# Altium project 数控模块.PrjPcb
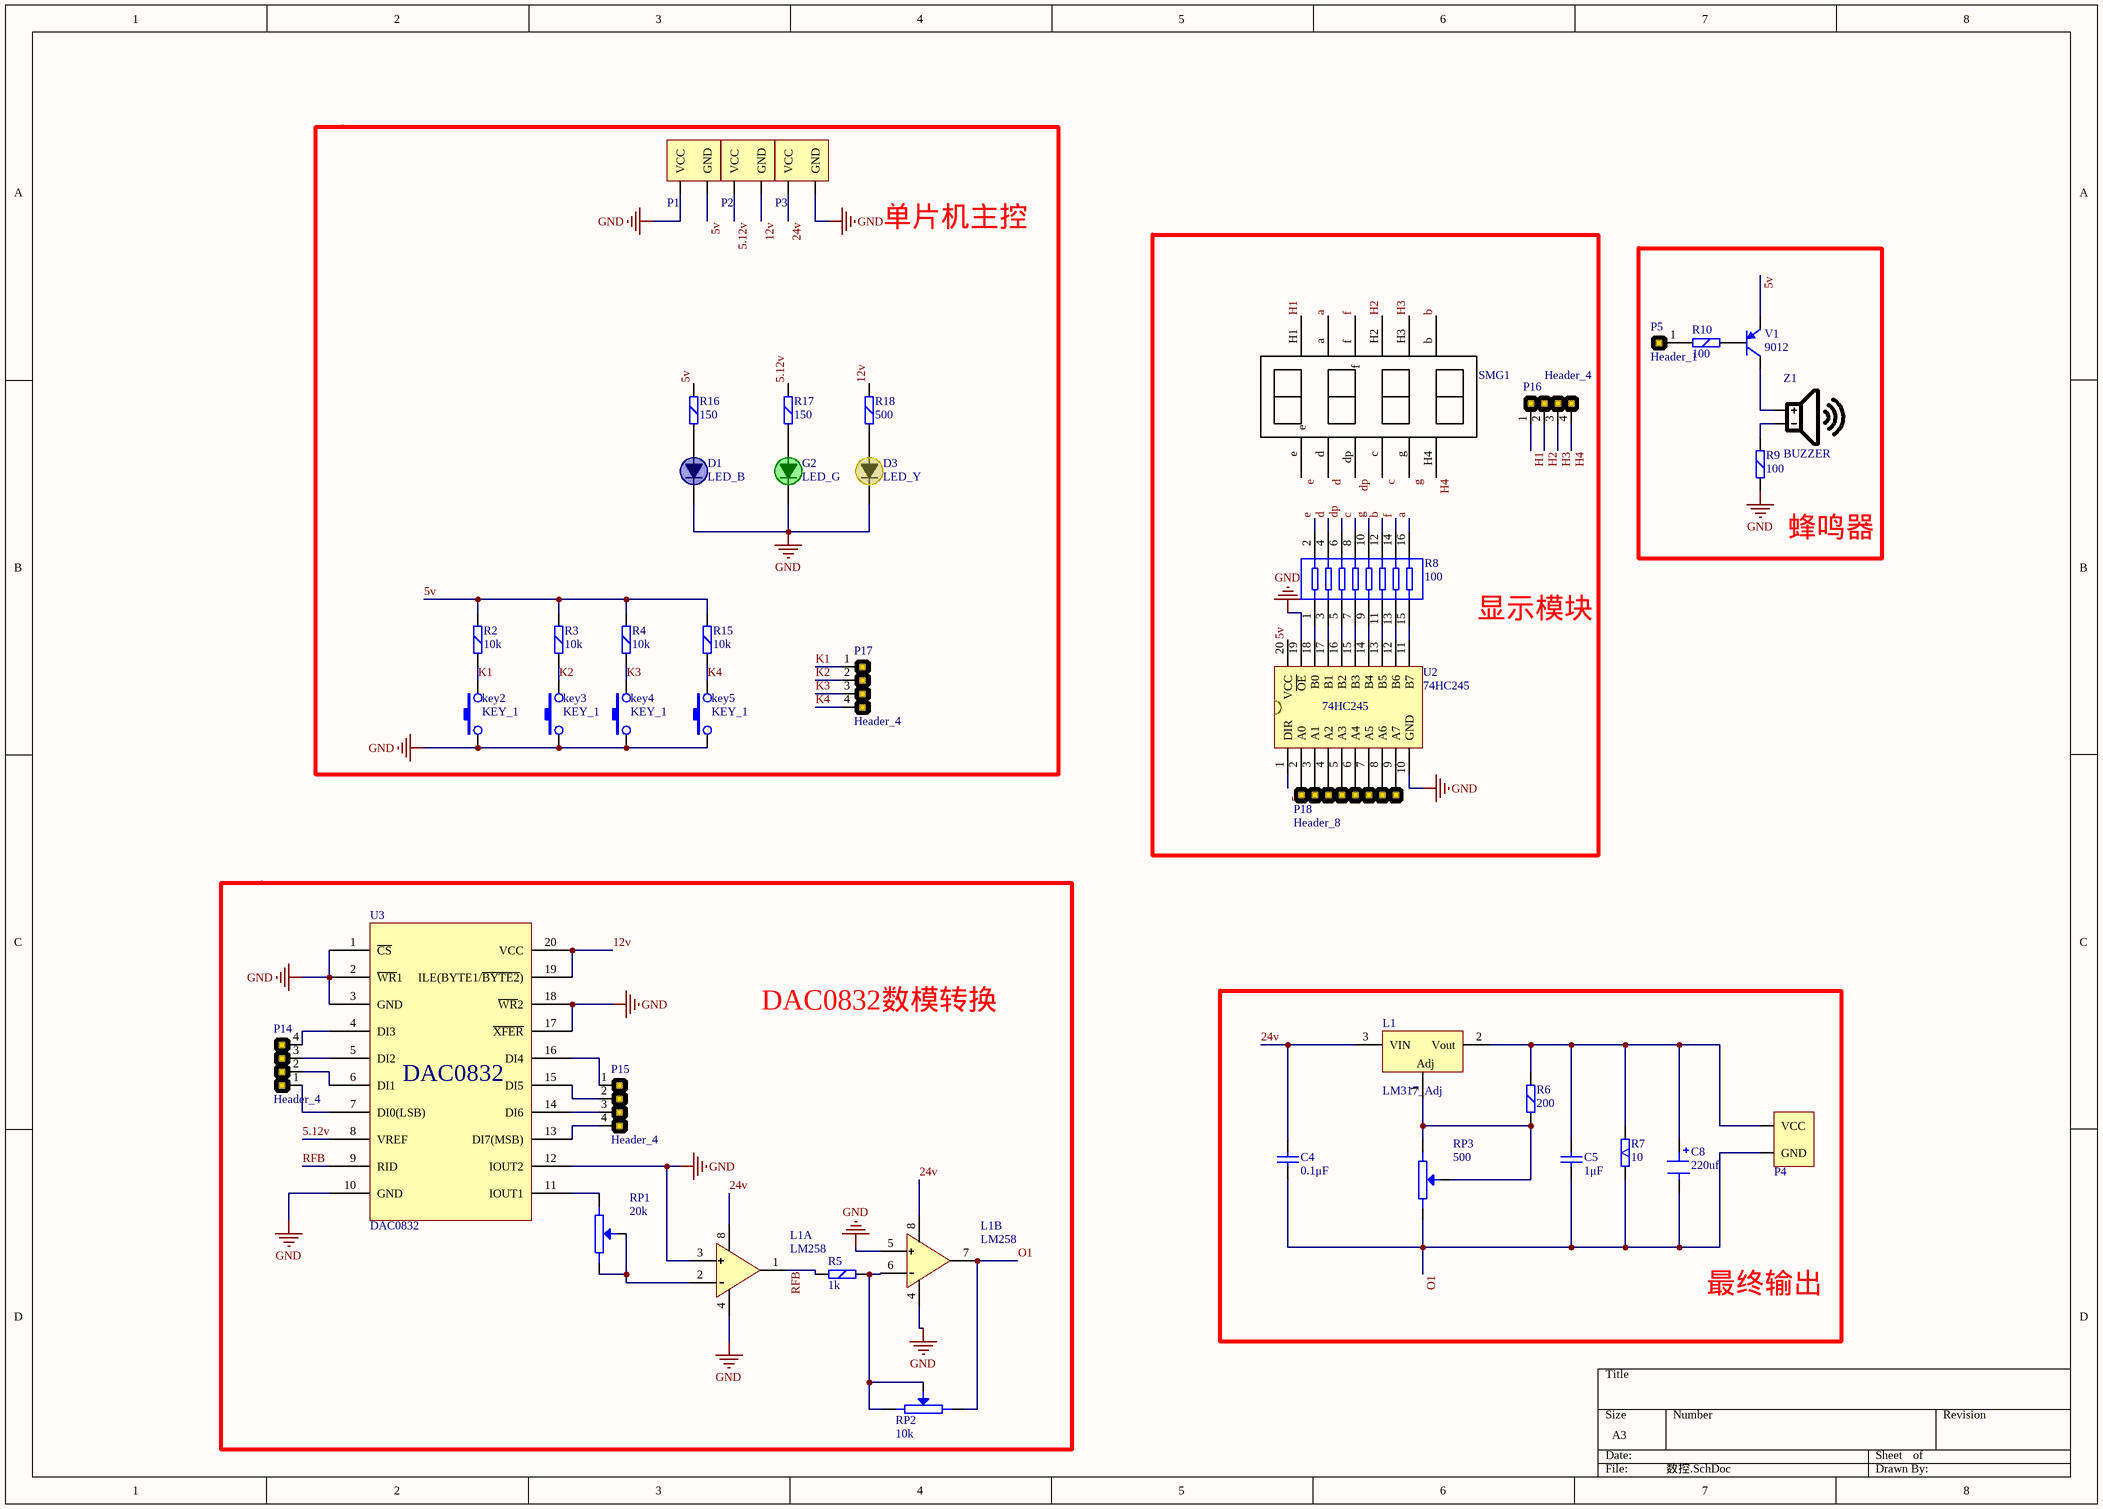
[diagram p0: 数控.SchDoc]
1 sheet, 43 parts. Net scope: global (net labels, ports and power ports of the same name join across sheets).
Board files: 数控_1.PcbDoc, 数控_2.PcbDoc

## Sheet 数控.SchDoc
size A3

### Parts
(Parts that share a designator on the sheet are numbered #1, #2 ... from top to bottom, then left to right.)
C4  0.1μF  [电容_瓷片]
C5  1μF  [电容_瓷片]
C8  220uf  [电解电容_小]
D1  LED_B  [LED_B]
D3  LED_Y  [LED_Y]
G2  LED_G  [LED_G]
key2  KEY_1  [AN66]
key3  KEY_1  [AN66]
key4  KEY_1  [AN66]
key5  KEY_1  [AN66]
L1#1  LM317_Adj  [7805散热器]
L1#2  LM258  [DIP8]  (parts A,B of 2)
P1  电源端子2P  [端子 - duplicate]  (value not drawn)
P2  电源端子2P  [端子 - duplicate]  (value not drawn)
P3  电源端子2P  [端子 - duplicate]  (value not drawn)
P4  电源端子2P  [端子 - duplicate]  (value not drawn)
P5  Header_1  [Header_1]
P14  Header_4  [Header_4]
P15  Header_4  [Header_4]
P16  Header_4  [Header_4]
P17  Header_4  [Header_4]
P18  Header_8  [Header_8]
R2  10k  [1/4WA1]
R3  10k  [1/4WA1]
R4  10k  [1/4WA1]
R5  1k  [1/4WA1]
R6  200  [1/4WA1]
R7  10  [AXIAL-20*5MM-W]
R8  100  [RES_PACK - 2]
R9  100  [1/4WA1]
R10  100  [1/4WA1]
R15  10k  [1/4WA1]
R16  150  [1/4WA1]
R17  150  [1/4WA1]
R18  500  [1/4WA1]
RP1  20k  [3296-203]
RP2  10k  [3296-100]
RP3  500  [3296-103]
SMG1  数码管  [4IN1B - 0.4英寸]  (value not drawn)
U2  74HC245  [DIP20]
U3  DAC0832  [DIP20]
V1  9012  [三极管PNP]
Z1  BUZZER  [BUZZER]

### Blocks framed on the sheet
单片机主控: D1 D3 G2 key2-key5 P1-P3 P17 R2-R4 R15-R18
显示模块: P16 P18 R8 SMG1 U2
蜂鸣器: P5 R9 R10 V1 Z1
DAC0832数模转换: L1#2 P14 P15 R5 RP1 RP2 U3
最终输出: C4 C5 C8 L1#1 P4 R6 R7 RP3

### Nets
GND: D1.2(K) D3.2(K) G2.2(K) key2.1 key3.1 key4.1 key5.1 L1#2.3 L1#2.4 L1#2.5 P1.1(VCC) P3.2(GND) R9.1 U2.10(GND) U2.19(~{OE}) U3.1(~{CS}) U3.2(~{WR}1) U3.3(GND) U3.10(GND) U3.12(IOUT2) U3.17(~{XFER}) U3.18(~{WR}2)
5.12v: P2.1(VCC) R17.1 U3.8(VREF)
5v: P1.2(GND) R2.1 R3.1 R4.1 R15.1 R16.1 U2.1(DIR) U2.20(VCC) V1.E
12v: P2.2(GND) R18.1 U3.19(ILE(BYTE1/~{BYTE2})) U3.20(VCC)
24v: C4.2 L1#1.3(VIN) L1#2.8 P3.1(VCC)
a: R8.16 SMG1.a
b: R8.12 SMG1.b
c: R8.8 SMG1.c
d: R8.4 SMG1.d
dp: R8.6 SMG1.dp(d)
e: R8.2 SMG1.e
f: R8.14 SMG1.f
g: R8.10 SMG1.g
H1: P16.1 SMG1.H1
H2: P16.2 SMG1.H2
H3: P16.3 SMG1.H3
H4: P16.4 SMG1.H4
K1: key2.2 P17.1 R2.2
K2: key3.2 P17.2 R3.2
K3: key4.2 P17.3 R4.2
K4: key5.2 P17.4 R15.2
O1: C4.1 C5.1 C8.2 L1#2.7 P4.2(GND) R7.2 RP2.2 RP3.2
RFB: L1#2.1 R5.1 U3.9(RID)
NetC5_2: C5.2 C8.1 L1#1.2(Vout) P4.1(VCC) R6.1 R7.1
NetD1_1: D1.1(A) R16.2
NetD3_1: D3.1(A) R18.2
NetG2_1: G2.1(A) R17.2
NetL1#1_1: L1#1.1(Adj) R6.2 RP3.1 RP3.3
NetL1#2_2: L1#2.2 RP1.2 RP1.3
NetL1#2_6: L1#2.6 R5.2 RP2.1 RP2.3
NetP5_1: P5.1 R10.1
NetP14_1: P14.1 U3.7(DI0(LSB))
NetP14_2: P14.2 U3.6(DI1)
NetP14_3: P14.3 U3.5(DI2)
NetP14_4: P14.4 U3.4(DI3)
NetP15_1: P15.1 U3.16(DI4)
NetP15_2: P15.2 U3.15(DI5)
NetP15_3: P15.3 U3.14(DI6)
NetP15_4: P15.4 U3.13(DI7(MSB))
NetP18_1: P18.1 U2.9(A7)
NetP18_2: P18.2 U2.8(A6)
NetP18_3: P18.3 U2.7(A5)
NetP18_4: P18.4 U2.6(A4)
NetP18_5: P18.5 U2.5(A3)
NetP18_6: P18.6 U2.4(A2)
NetP18_7: P18.7 U2.3(A1)
NetP18_8: P18.8 U2.2(A0)
NetR8_1: R8.1 U2.18(B0)
NetR8_3: R8.3 U2.17(B1)
NetR8_5: R8.5 U2.16(B2)
NetR8_7: R8.7 U2.15(B3)
NetR8_9: R8.9 U2.14(B4)
NetR8_11: R8.11 U2.13(B5)
NetR8_13: R8.13 U2.12(B6)
NetR8_15: R8.15 U2.11(B7)
NetR9_2: R9.2 Z1.2
NetR10_2: R10.2 V1.B
NetRP1_1: RP1.1 U3.11(IOUT1)
NetV1_C: V1.C Z1.1

### Library data of the parts
C4 C5 = 电容_瓷片: 瓷片电容
C8 = 电解电容_小: 电解电容
D1 = LED_B: 发光二极管
D3 = LED_Y: 发光二极管
G2 = LED_G: 发光二极管
L1#1 = LM317: 可调直流稳压芯片
P1-P4 = 电源端子2P: 电源端子
P5 = Header_1: 插针; Comm: 插针1
P14-P17 = Header_4: 插针; Comm: 插针4
P18 = Header_8: 插针; Comm: 插针8
R2-R4 R15 = Res_3: 1/4W电阻器; Object: Resistor; Kind: General; Latest Revision Note: 最近的应用笔记修订本; Component Link1Description: 元件数据连接1，一般是生产厂商的元件描述连接。; ComponentLink2  Description: 元件数据连接2，一般是生产厂商的元件数据库连接。; Component Link 1URL: 元件厂商的网站连接1，通常是主页地址，如http://www.st.com/; Component Link 2URL: 元件厂商的网站连接2，通常是元件数据说明文件地址，如http://www.fairchildsemi.com/ds/2N%2F2N3904.pdf; LatestRevisionDate: 13-Apr-2016; Published: 13-Apr-2016; Publisher: Altium Limited; Created: 制造厂商; Datasheet Version: Apr-2016; Package Reference: AXIAL; Spice Prefix: R; Latest Revision Date: 13-Apr-2016; Package Description: AXIAL0.3-AXIA1.0; PackageVersion: Apr-2016; SubKind: Resistor; Type: Resistor; Value: 10K
R5 R6 R9 R10 R16-R18 = Res_3: 1/4W电阻器; Object: Resistor; Kind: General; Latest Revision Note: 最近的应用笔记修订本; Component Link1Description: 元件数据连接1，一般是生产厂商的元件描述连接。; ComponentLink2  Description: 元件数据连接2，一般是生产厂商的元件数据库连接。; Component Link 1URL: 元件厂商的网站连接1，通常是主页地址，如http://www.st.com/; Component Link 2URL: 元件厂商的网站连接2，通常是元件数据说明文件地址，如http://www.fairchildsemi.com/ds/2N%2F2N3904.pdf; Value: 10K; LatestRevisionDate: 13-Apr-2016; Published: 13-Apr-2016; Publisher: Altium Limited; Created: 制造厂商; Datasheet Version: Apr-2016; Package Reference: AXIAL; Spice Prefix: R; Latest Revision Date: 13-Apr-2016; Package Description: AXIAL0.3-AXIA1.0; PackageVersion: Apr-2016; SubKind: Resistor; Type: Resistor
R7 = Res_7: 5W电阻器; Object: Resistor; Kind: General; Latest Revision Note: 最近的应用笔记修订本; Component Link1Description: 元件数据连接1，一般是生产厂商的元件描述连接。; ComponentLink2  Description: 元件数据连接2，一般是生产厂商的元件数据库连接。; Component Link 1URL: 元件厂商的网站连接1，通常是主页地址，如http://www.st.com/; Component Link 2URL: 元件厂商的网站连接2，通常是元件数据说明文件地址，如http://www.fairchildsemi.com/ds/2N%2F2N3904.pdf; Value: 10K; LatestRevisionDate: 13-Apr-2016; Published: 13-Apr-2016; Publisher: Altium Limited; Created: 制造厂商; Datasheet Version: Apr-2016; Package Reference: AXIAL; Spice Prefix: R; Latest Revision Date: 13-Apr-2016; Package Description: AXIAL0.3-AXIA1.0; PackageVersion: Apr-2016; SubKind: Resistor; Type: Resistor
R8 = Res_Pack8: 排阻; Object: Resistor; Kind: General; Latest Revision Note: 最近的应用笔记修订本; Component Link1Description: 元件数据连接1，一般是生产厂商的元件描述连接。; ComponentLink2  Description: 元件数据连接2，一般是生产厂商的元件数据库连接。; Component Link 1URL: 元件厂商的网站连接1，通常是主页地址，如http://www.st.com/; Component Link 2URL: 元件厂商的网站连接2，通常是元件数据说明文件地址，如http://www.fairchildsemi.com/ds/2N%2F2N3904.pdf; Value: 10K; LatestRevisionDate: 13-Apr-2016; Published: 13-Apr-2016; Publisher: Altium Limited; Created: 制造厂商; Datasheet Version: Apr-2016; Package Reference: AXIAL; Spice Prefix: R; Latest Revision Date: 13-Apr-2016; Package Description: AXIAL0.3-AXIA1.0; PackageVersion: Apr-2016; SubKind: Resistor; Type: Resistor
RP1 RP3 = RESVR: 滑动触点电位器; Object: Resistor; Kind: General; Latest Revision Note: 最近的应用笔记修订本; Component Link1Description: 元件数据连接1，一般是生产厂商的元件描述连接。; ComponentLink2  Description: 元件数据连接2，一般是生产厂商的元件数据库连接。; Component Link 1URL: 元件厂商的网站连接1，通常是主页地址，如http://www.st.com/; Component Link 2URL: 元件厂商的网站连接2，通常是元件数据说明文件地址，如http://www.fairchildsemi.com/ds/2N%2F2N3904.pdf; Value: 10K; LatestRevisionDate: 13-Apr-2016; Published: 13-Apr-2016; Publisher: Altium Limited; Created: 制造厂商; Datasheet Version: Apr-2016; Package Reference: AXIAL; Spice Prefix: R; Latest Revision Date: 13-Apr-2016; Package Description: AXIAL0.3-AXIA1.0; PackageVersion: Apr-2016; SubKind: Resistor; Type: Resistor
RP2 = RESVR: 滑动触点电位器; Object: Resistor; Kind: General; Latest Revision Note: 最近的应用笔记修订本; Component Link1Description: 元件数据连接1，一般是生产厂商的元件描述连接。; ComponentLink2  Description: 元件数据连接2，一般是生产厂商的元件数据库连接。; Component Link 1URL: 元件厂商的网站连接1，通常是主页地址，如http://www.st.com/; Component Link 2URL: 元件厂商的网站连接2，通常是元件数据说明文件地址，如http://www.fairchildsemi.com/ds/2N%2F2N3904.pdf; LatestRevisionDate: 13-Apr-2016; Published: 13-Apr-2016; Publisher: Altium Limited; Created: 制造厂商; Datasheet Version: Apr-2016; Package Reference: AXIAL; Spice Prefix: R; Latest Revision Date: 13-Apr-2016; Package Description: AXIAL0.3-AXIA1.0; PackageVersion: Apr-2016; SubKind: Resistor; Type: Resistor; Value: 10K
SMG1 = 4位数码管
U2 = 74HC245: 总线驱动器
U3 = DAC0832: 数模转换器件; Component Link1Description: 元件数据连接1，一般是生产厂商的元件描述连接。; Component Link 1URL: 元件厂商的网站连接1，通常是主页地址，如http://www.st.com/; ComponentLink2  Description: 元件数据连接2，一般是生产厂商的元件数据库连接。; Component Link 2URL: 元件厂商的网站连接2，通常是元件数据说明文件地址，如http://www.fairchildsemi.com/ds/2N%2F2N3904.pdf; Kind: General; Latest Revision Note: 最近的应用笔记修订本; SubKind: Chip; 价格: 0.0; Created: 制造厂商; Datasheet Version: Apr-2016; Latest Revision Date: 14-Apr-2016; Package Description: 封装描述; Published: 14-Apr-2016; Publisher: Altium Limited; Spice Prefix: U; LatestRevisionDate: 5-Sep-2016
V1 = 9012三极管: PNP三极管
Z1 = BUZZER: 蜂鸣器